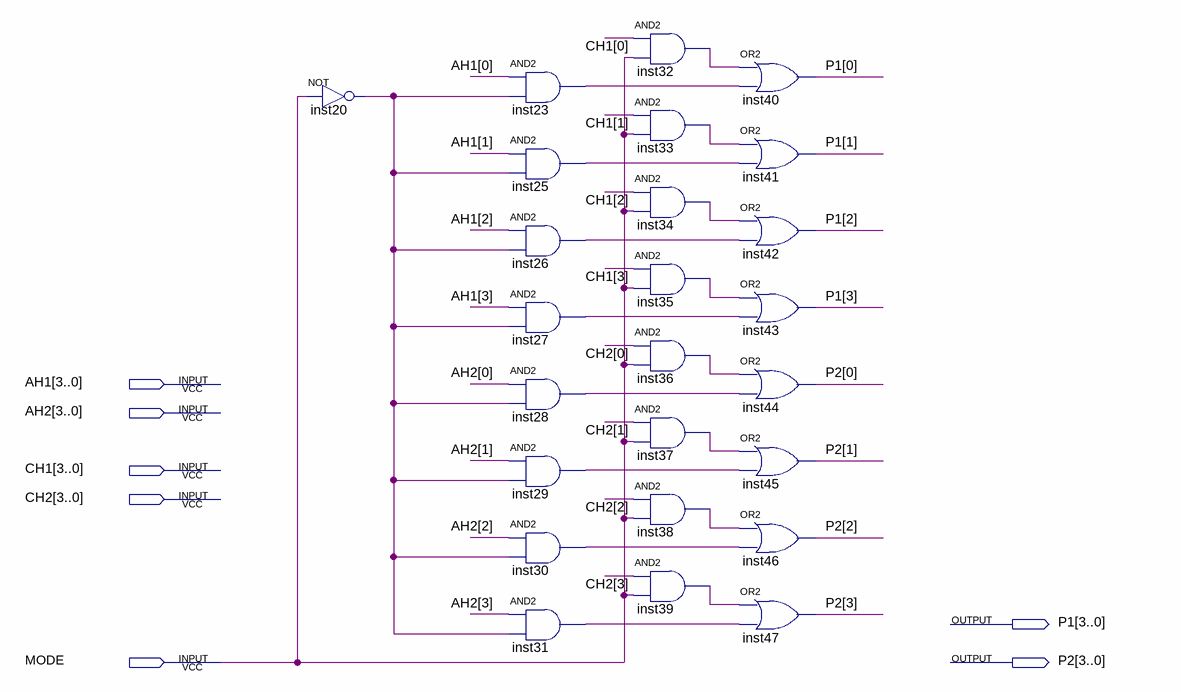
[diagram p0: schematic sheet]
// Quartus schematic Selector.bdf as structural Verilog: 25 symbols, 7 pins
module Selector (
  input  [3:0] AH1,
  input  [3:0] AH2,
  input  [3:0] CH1,
  input  [3:0] CH2,
  input  MODE,
  output [3:0] P1,
  output [3:0] P2
);

  wire inst20_out, inst23_out, inst25_out, inst26_out, inst27_out, inst28_out, inst29_out, inst30_out,
       inst31_out, inst32_out, inst33_out, inst34_out, inst35_out, inst36_out, inst37_out, inst38_out,
       inst39_out;

  not inst20 (inst20_out, MODE);
  and inst23 (inst23_out, AH1[0], inst20_out);
  and inst25 (inst25_out, AH1[1], inst20_out);
  and inst26 (inst26_out, AH1[2], inst20_out);
  and inst27 (inst27_out, AH1[3], inst20_out);
  and inst28 (inst28_out, AH2[0], inst20_out);
  and inst29 (inst29_out, AH2[1], inst20_out);
  and inst30 (inst30_out, AH2[2], inst20_out);
  and inst31 (inst31_out, AH2[3], inst20_out);
  and inst32 (inst32_out, CH1[0], MODE);
  and inst33 (inst33_out, CH1[1], MODE);
  and inst34 (inst34_out, CH1[2], MODE);
  and inst35 (inst35_out, CH1[3], MODE);
  and inst36 (inst36_out, CH2[0], MODE);
  and inst37 (inst37_out, CH2[1], MODE);
  and inst38 (inst38_out, CH2[2], MODE);
  and inst39 (inst39_out, CH2[3], MODE);
  or inst40 (P1[0], inst32_out, inst23_out);
  or inst41 (P1[1], inst33_out, inst25_out);
  or inst42 (P1[2], inst34_out, inst26_out);
  or inst43 (P1[3], inst35_out, inst27_out);
  or inst44 (P2[0], inst36_out, inst28_out);
  or inst45 (P2[1], inst37_out, inst29_out);
  or inst46 (P2[2], inst38_out, inst30_out);
  or inst47 (P2[3], inst39_out, inst31_out);
endmodule
